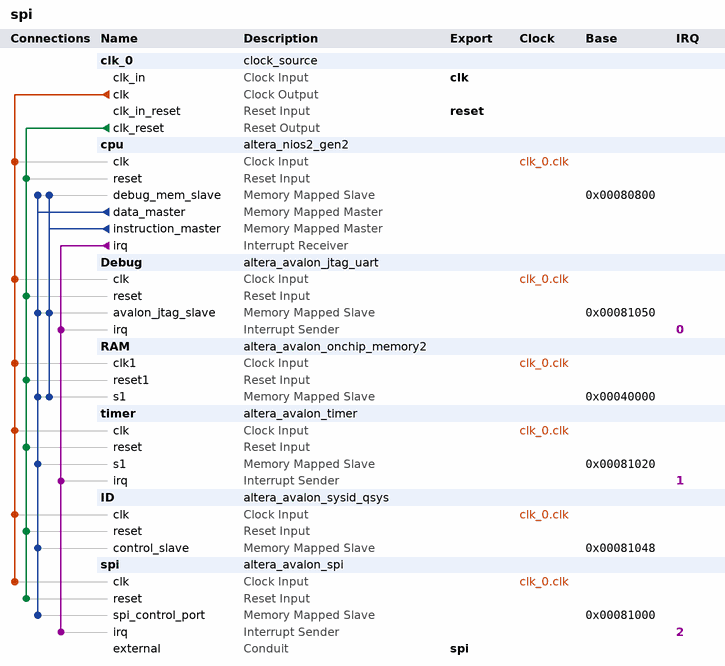
[diagram p0: system contents]
# Platform Designer (Qsys) system spi, Cyclone IV E EP4CE115F29C7
# Parameters at their usual value, and those the tool derives, are not listed.
package require -exact qsys 17.1
create_system spi
set_project_property DEVICE_FAMILY {Cyclone IV E}
set_project_property DEVICE EP4CE115F29C7

add_instance clk_0 clock_source 17.1
set_instance_parameter_value clk_0 clockFrequency 50000000

add_instance cpu altera_nios2_gen2 17.1
set_instance_parameter_value cpu dcache_size 2048
set_instance_parameter_value cpu exceptionSlave RAM.s1
set_instance_parameter_value cpu icache_size 4096
set_instance_parameter_value cpu impl Tiny
set_instance_parameter_value cpu resetSlave RAM.s1

add_instance Debug altera_avalon_jtag_uart 17.1
set_instance_parameter_value Debug simInteractiveOptions NO_INTERACTIVE_WINDOWS

add_instance RAM altera_avalon_onchip_memory2 17.1
set_instance_parameter_value RAM dataWidth 32
set_instance_parameter_value RAM dualPort false
set_instance_parameter_value RAM initMemContent true
set_instance_parameter_value RAM initializationFileName onchip_mem.hex
set_instance_parameter_value RAM memorySize 204800

add_instance timer altera_avalon_timer 17.1
set_instance_parameter_value timer period 1
set_instance_parameter_value timer periodUnits USEC

add_instance ID altera_avalon_sysid_qsys 17.1
set_instance_parameter_value ID id 0

add_instance spi altera_avalon_spi 17.1
set_instance_parameter_value spi clockPolarity 0
set_instance_parameter_value spi dataWidth 8
set_instance_parameter_value spi masterSPI true
set_instance_parameter_value spi numberOfSlaves 1
set_instance_parameter_value spi targetClockRate 128000

# connections
add_connection clk_0.clk cpu.clk clock
add_connection clk_0.clk Debug.clk clock
add_connection clk_0.clk ID.clk clock
add_connection clk_0.clk RAM.clk1 clock
add_connection clk_0.clk spi.clk clock
add_connection clk_0.clk timer.clk clock
add_connection clk_0.clk_reset cpu.reset reset
add_connection clk_0.clk_reset Debug.reset reset
add_connection clk_0.clk_reset ID.reset reset
add_connection clk_0.clk_reset RAM.reset1 reset
add_connection clk_0.clk_reset spi.reset reset
add_connection clk_0.clk_reset timer.reset reset
add_connection cpu.data_master cpu.debug_mem_slave avalon
set_connection_parameter_value cpu.data_master/cpu.debug_mem_slave baseAddress 0x00080800
add_connection cpu.data_master Debug.avalon_jtag_slave avalon
set_connection_parameter_value cpu.data_master/Debug.avalon_jtag_slave baseAddress 0x00081050
add_connection cpu.data_master ID.control_slave avalon
set_connection_parameter_value cpu.data_master/ID.control_slave baseAddress 0x00081048
add_connection cpu.data_master RAM.s1 avalon
set_connection_parameter_value cpu.data_master/RAM.s1 baseAddress 0x00040000
add_connection cpu.data_master spi.spi_control_port avalon
set_connection_parameter_value cpu.data_master/spi.spi_control_port baseAddress 0x00081000
add_connection cpu.data_master timer.s1 avalon
set_connection_parameter_value cpu.data_master/timer.s1 baseAddress 0x00081020
add_connection cpu.instruction_master cpu.debug_mem_slave avalon
set_connection_parameter_value cpu.instruction_master/cpu.debug_mem_slave baseAddress 0x00080800
add_connection cpu.instruction_master Debug.avalon_jtag_slave avalon
set_connection_parameter_value cpu.instruction_master/Debug.avalon_jtag_slave baseAddress 0x00081050
add_connection cpu.instruction_master RAM.s1 avalon
set_connection_parameter_value cpu.instruction_master/RAM.s1 baseAddress 0x00040000
add_connection cpu.irq Debug.irq interrupt
set_connection_parameter_value cpu.irq/Debug.irq irqNumber 0
add_connection cpu.irq spi.irq interrupt
set_connection_parameter_value cpu.irq/spi.irq irqNumber 2
add_connection cpu.irq timer.irq interrupt
set_connection_parameter_value cpu.irq/timer.irq irqNumber 1

# exported interfaces
add_interface clk clock sink
set_interface_property clk EXPORT_OF clk_0.clk_in
add_interface reset reset sink
set_interface_property reset EXPORT_OF clk_0.clk_in_reset
add_interface spi conduit end
set_interface_property spi EXPORT_OF spi.external

set_interconnect_requirement {$system} qsys_mm.clockCrossingAdapter HANDSHAKE
set_interconnect_requirement {$system} qsys_mm.enableEccProtection FALSE
set_interconnect_requirement {$system} qsys_mm.insertDefaultSlave FALSE
set_interconnect_requirement {$system} qsys_mm.maxAdditionalLatency 1

save_system spi.qsys
